# EAGLE design Main schematic (EAGLE 9.5.1)
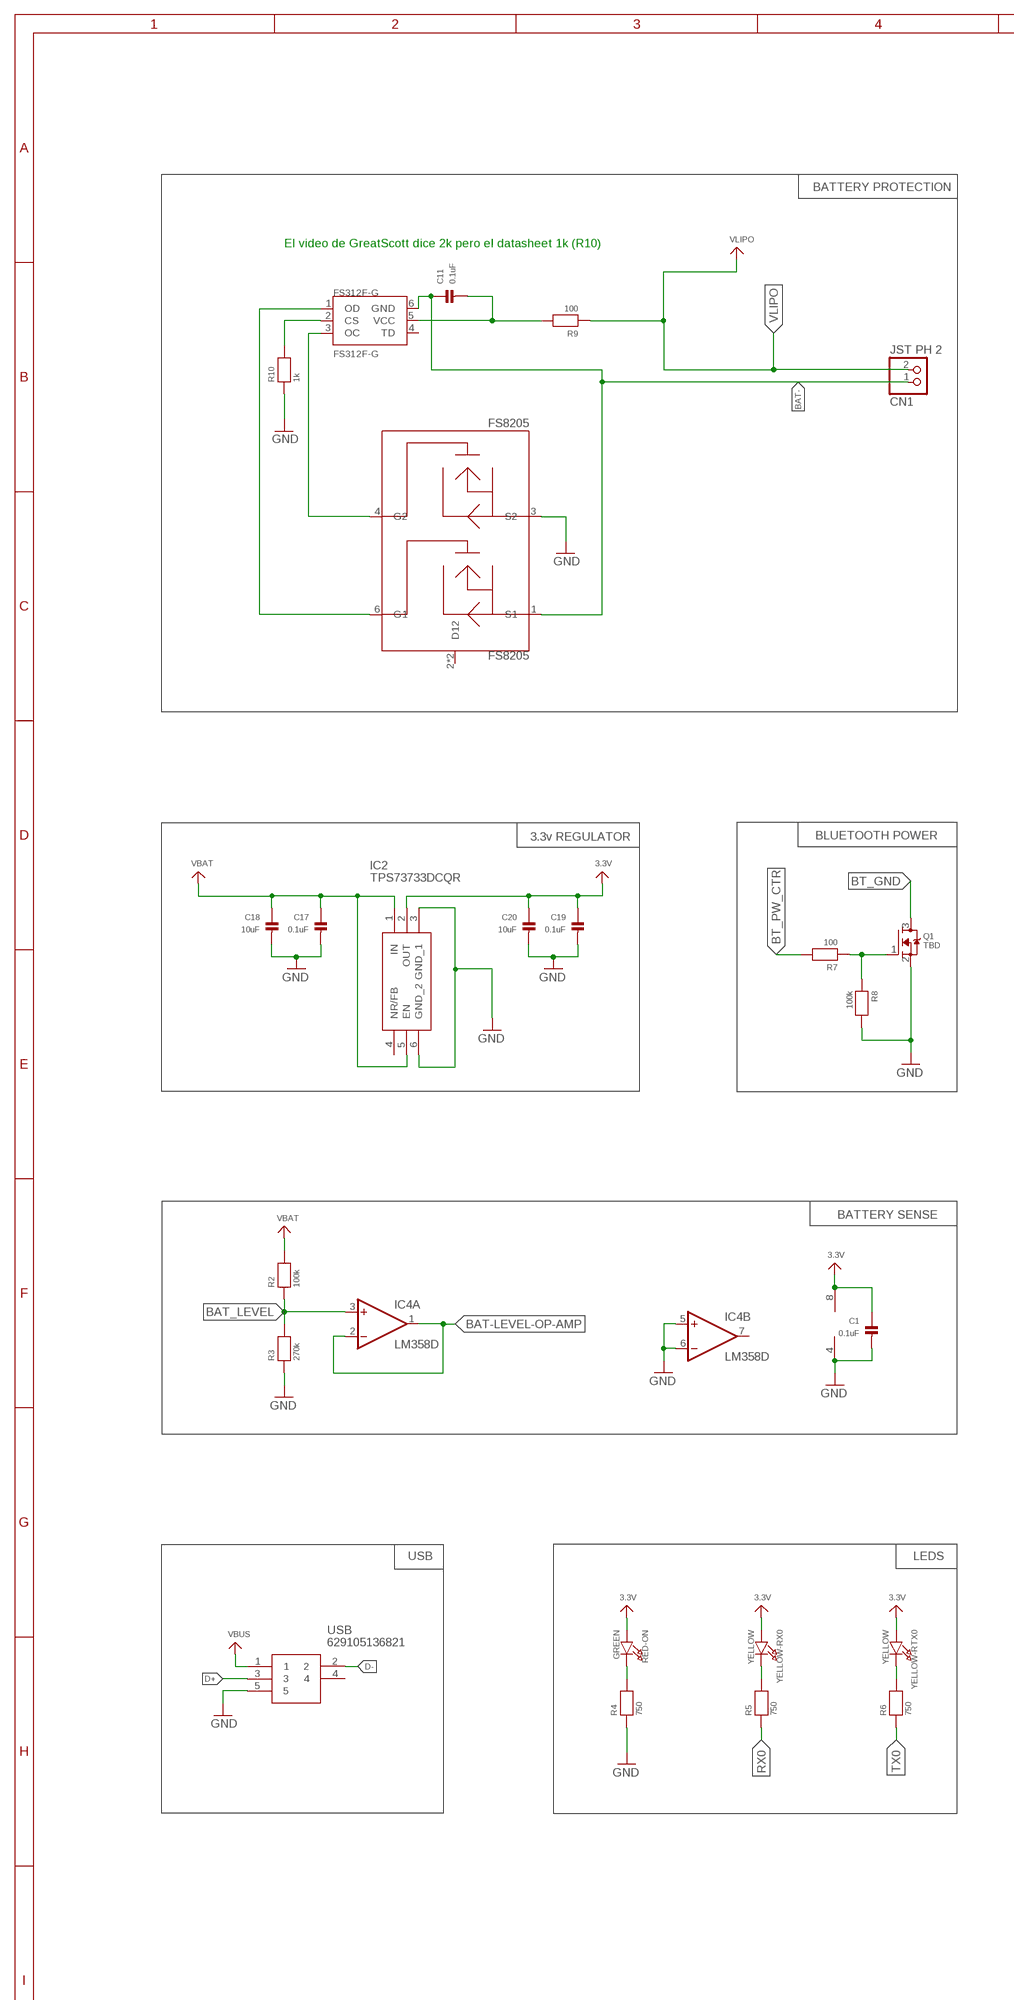
[diagram p0: schematic, sheet 1, part 1 of 2]
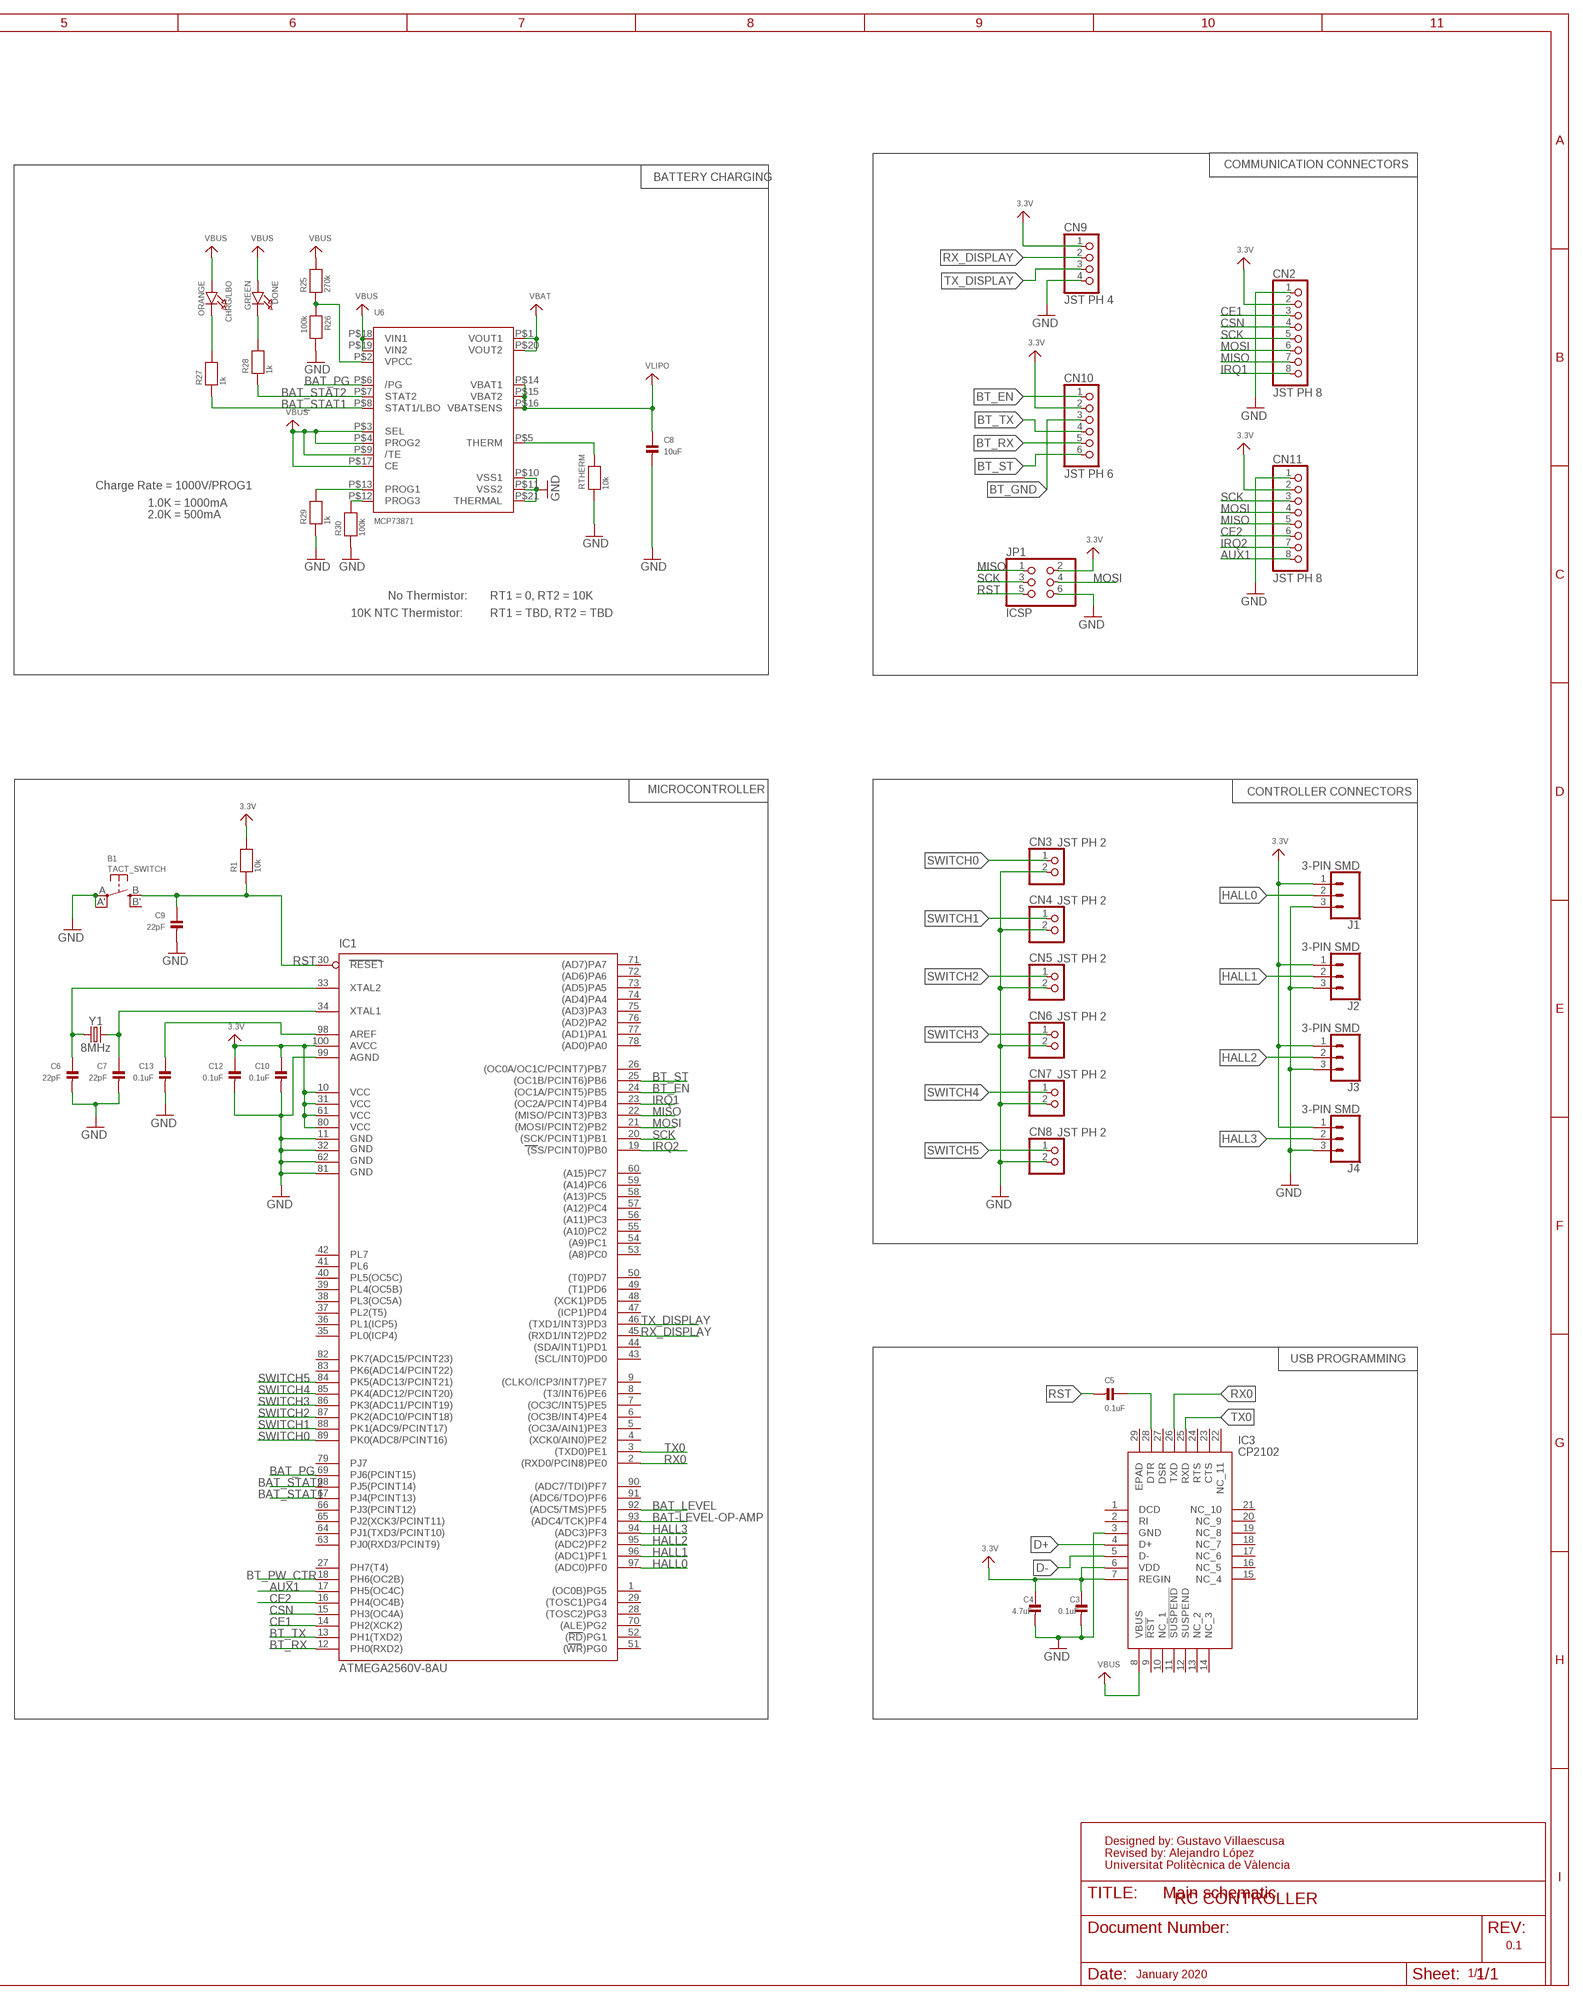
[diagram p1: schematic, sheet 1, part 2 of 2]

## Parts
B1  TACT_SWITCH  SWITCH_TACT_SMT4.6X2.8  [BTN_KMR2_4.6X2.8]
C1  0.1uF  CAP_CERAMIC0805  [0805]
C3  0.1uF  CAP_CERAMIC0805  [0805]
C4  4.7uF  CAP_CERAMIC0805  [0805]
C5  0.1uF  CAP_CERAMIC0805  [0805]
C6  22pF  CAP_CERAMIC0805  [0805]
C7  22pF  CAP_CERAMIC0805  [0805]
C8  10uF  CAP_CERAMIC0805  [0805]
C9  22pF  CAP_CERAMIC0805  [0805]
C10  0.1uF  CAP_CERAMIC0805  [0805]
C11  0.1uF  CAP_CERAMIC0805  [0805]
C12  0.1uF  CAP_CERAMIC0805  [0805]
C13  0.1uF  CAP_CERAMIC0805  [0805]
C17  0.1uF  CAP_CERAMIC0805  [0805]
C18  10uF  CAP_CERAMIC0805  [0805]
C19  0.1uF  CAP_CERAMIC0805  [0805]
C20  10uF  CAP_CERAMIC0805  [0805]
CHRG/LBO  ORANGE  LED0805  [CHIPLED_0805]
CN1  JST PH 2  JST_2PIN  [JSTPH2]
CN2  JST PH 8  JST_8PIN  [JSTPH8]
CN3  JST PH 2  JST_2PIN  [JSTPH2]
CN4  JST PH 2  JST_2PIN  [JSTPH2]
CN5  JST PH 2  JST_2PIN  [JSTPH2]
CN6  JST PH 2  JST_2PIN  [JSTPH2]
CN7  JST PH 2  JST_2PIN  [JSTPH2]
CN8  JST PH 2  JST_2PIN  [JSTPH2]
CN9  JST PH 4  JST_4PIN  [JSTPH4]
CN10  JST PH 6  JST_6PIN  [JSTPH6]
CN11  JST PH 8  JST_8PIN  [JSTPH8]
DONE  GREEN  LED0805  [CHIPLED_0805]
FS312F-G  FS312F-G  [SOT23-6]
FS8205  FS8205  [SOT23-6]
IC1  ATMEGA2560V-8AU  [TQFP100]
IC2  TPS73733DCQR  [SOT127P706X180-6N]
IC3  CP2102  [QFN50P500X500X100-29N]
IC4  LM358D  [SO08]
J1  3-PIN SMD  CONN_03JST-SMD  [JST-3-SMD]
J2  3-PIN SMD  CONN_03JST-SMD  [JST-3-SMD]
J3  3-PIN SMD  CONN_03JST-SMD  [JST-3-SMD]
J4  3-PIN SMD  CONN_03JST-SMD  [JST-3-SMD]
JP1  ICSP  HEADER-2X3  [2X03_ROUND_70MIL]
Q1  TBD  MOSFET-NWIDE  [SOT23-WIDE]
R1  10k  RESISTOR0805  [0805]
R2  100k  RESISTOR0805  [0805]
R3  270k  RESISTOR0805  [0805]
R4  750  RESISTOR0805  [0805]
R5  750  RESISTOR0805  [0805]
R6  750  RESISTOR0805  [0805]
R7  100  RESISTOR0805  [0805]
R8  100k  RESISTOR0805  [0805]
R9  100  RESISTOR0805  [0805]
R10  1k  RESISTOR0805  [0805]
R25  270k  RESISTOR0805  [0805]
R26  100k  RESISTOR0805  [0805]
R27  1k  RESISTOR0805  [0805]
R28  1k  RESISTOR0805  [0805]
R29  1k  RESISTOR0805  [0805]
R30  100k  RESISTOR0805  [0805]
RED-ON  GREEN  LED0805  [CHIPLED_0805]
RTHERM  10k  RESISTOR0805  [0805]
U6  MCP73871  [QFN20_4MM]
USB  629105136821  [MICRO-USB(2.0-SMT-TYPE-B)]
Y1  8MHz  CRYSTAL-8MHZSMD-HC49UP  [HC49UP]
YELLOW-RTX0  YELLOW  LED0805  [CHIPLED_0805]
YELLOW-RX0  YELLOW  LED0805  [CHIPLED_0805]

## Nets
3.3V: C1.1 C3.1 C4.1 C10.1 C12.1 C19.1 C20.1 CN2.2 CN9.1 CN10.2 CN11.2 IC1.10(VCC) IC1.31(VCC1) IC1.61(VCC2) IC1.80(VCC3) IC1.100(AVCC) IC2.2(OUT) IC3.6(VDD) IC3.7(REGIN) IC4.8(P:V+) J1.1 J2.1 J3.1 J4.1 JP1.2 R1.2 RED-ON.A YELLOW-RTX0.A YELLOW-RX0.A
AUX1: CN11.8 IC1.17(PH5(OC4C))
BAT-: C11.1 CN1.1 FS312F-G.6(GND) FS8205.1(S1)
BAT-LEVEL-OP-AMP: IC1.93((ADC4/TCK)PF4) IC4.1(A:OUT) IC4.2(A:-IN)
BAT_LEVEL: IC1.92((ADC5/TMS)PF5) IC4.3(A:+IN) R2.1 R3.2
BAT_PG: IC1.69(PJ6(PCINT15)) U6.P$6(/PG)
BAT_STAT1: IC1.67(PJ4(PCINT13)) R27.1 U6.P$8(STAT1/LBO)
BAT_STAT2: IC1.68(PJ5(PCINT14)) R28.1 U6.P$7(STAT2)
BT_EN: CN10.1 IC1.24((OC1A/PCINT5)PB5)
BT_GND: CN10.3 Q1.3(D)
BT_PW_CTR: IC1.18(PH6(OC2B)) R7.2
BT_RX: CN10.5 IC1.12(PH0(RXD2))
BT_ST: CN10.6 IC1.25((OC1B/PCINT6)PB6)
BT_TX: CN10.4 IC1.13(PH1(TXD2))
CE1: CN2.3 IC1.14(PH2(XCK2))
CE2: CN11.6 IC1.16(PH4(OC4B))
CSN: CN2.4 IC1.15(PH3(OC4A))
D+: IC3.4(D+) USB.3
D-: IC3.5(D-) USB.2
GND: B1.A'(P1) B1.A(P) C1.2 C3.2 C4.2 C6.2 C7.2 C8.2 C9.2 C10.2 C12.2 C13.2 C17.2 C18.2 C19.2 C20.2 CN2.1 CN3.2 CN4.2 CN5.2 CN6.2 CN7.2 CN8.2 CN9.4 CN11.1 FS8205.3(S2) IC1.11(GND) IC1.32(GND1) IC1.62(GND2) IC1.81(GND3) IC1.99(AGND) IC2.3(GND_1) IC2.6(GND_2) IC3.3(GND) IC4.4(P:V-) IC4.5(B:+IN) IC4.6(B:-IN) J1.3 J2.3 J3.3 J4.3 JP1.6 Q1.2(S) R3.1 R4.1 R8.2 R10.1 R26.2 R29.1 R30.1 RTHERM.1 U6.P$10(VSS1) U6.P$11(VSS2) U6.P$21(THERMAL) USB.5
GREEN: DONE.C R28.2
HALL0: IC1.97((ADC0)PF0) J1.2
HALL1: IC1.96((ADC1)PF1) J2.2
HALL2: IC1.95((ADC2)PF2) J3.2
HALL3: IC1.94((ADC3)PF3) J4.2
IRQ1: CN2.8 IC1.23((OC2A/PCINT4)PB4)
IRQ2: CN11.7 IC1.19((SS/PCINT0)PB0)
MISO: CN2.7 CN11.5 IC1.22((MISO/PCINT3)PB3) JP1.1
MOSI: CN2.6 CN11.4 IC1.21((MOSI/PCINT2)PB2) JP1.4
N$1: C6.1 IC1.33(XTAL2) Y1.1
N$2: C13.1 IC1.98(AREF)
N$3: C5.1 IC3.28(DTR)
N$4: C7.1 IC1.34(XTAL1) Y1.2
N$5: R4.2 RED-ON.C
N$6: R5.2 YELLOW-RX0.C
N$7: RTHERM.2 U6.P$5(THERM)
N$8: R25.1 R26.1 U6.P$2(VPCC)
N$9: R6.2 YELLOW-RTX0.C
N$10: C11.2 FS312F-G.5(VCC) R9.2
N$12: Q1.1(G) R7.1 R8.1
N$16: FS312F-G.3(OC) FS8205.4(G2)
N$17: FS312F-G.1(OD) FS8205.6(G1)
N$18: FS312F-G.2(CS) R10.2
N$25: R29.2 U6.P$13(PROG1)
N$29: R30.2 U6.P$12(PROG3)
ORANGE: CHRG/LBO.C R27.2
RST: B1.B(S) C5.2 C9.1 IC1.30(RESET) JP1.5 R1.1
RX0: IC1.2((RXD0/PCIN8)PE0) IC3.26(TXD) R5.1
RX_DISPLAY: CN9.2 IC1.45((RXD1/INT2)PD2)
SCK: CN2.5 CN11.3 IC1.20((SCK/PCINT1)PB1) JP1.3
SWITCH0: CN3.1 IC1.89(PK0(ADC8/PCINT16))
SWITCH1: CN4.1 IC1.88(PK1(ADC9/PCINT17))
SWITCH2: CN5.1 IC1.87(PK2(ADC10/PCINT18))
SWITCH3: CN6.1 IC1.86(PK3(ADC11/PCINT19))
SWITCH4: CN7.1 IC1.85(PK4(ADC12/PCINT20))
SWITCH5: CN8.1 IC1.84(PK5(ADC13/PCINT21))
TX0: IC1.3((TXD0)PE1) IC3.25(RXD) R6.1
TX_DISPLAY: CN9.3 IC1.46((TXD1/INT3)PD3)
VBAT: C17.1 C18.1 IC2.1(IN) IC2.5(EN) R2.2 U6.P$1(VOUT1) U6.P$20(VOUT2)
VBUS: CHRG/LBO.A DONE.A IC3.8(VBUS) R25.2 U6.P$3(SEL) U6.P$4(PROG2) U6.P$9(/TE) U6.P$17(CE) U6.P$18(VIN1) U6.P$19(VIN2) USB.1
VLIPO: C8.1 CN1.2 R9.1 U6.P$14(VBAT1) U6.P$15(VBAT2) U6.P$16(VBATSENS)
Unconnected: B1.B'(S1) FS312F-G.4(TD) FS8205.2(D12) FS8205.5(D12) IC1.1((OC0B)PG5) IC1.4((XCK0/AIN0)PE2) IC1.5((OC3A/AIN1)PE3) IC1.6((OC3B/INT4)PE4) IC1.7((OC3C/INT5)PE5) IC1.8((T3/INT6)PE6) IC1.9((CLKO/ICP3/INT7)PE7) IC1.26((OC0A/OC1C/PCINT7)PB7) IC1.27(PH7(T4)) IC1.28((TOSC2)PG3) IC1.29((TOSC1)PG4) IC1.35(PL0(ICP4)) IC1.36(PL1(ICP5)) IC1.37(PL2(T5)) IC1.38(PL3(OC5A)) IC1.39(PL4(OC5B)) IC1.40(PL5(OC5C)) IC1.41(PL6) IC1.42(PL7) IC1.43((SCL/INT0)PD0) IC1.44((SDA/INT1)PD1) IC1.47((ICP1)PD4) IC1.48((XCK1)PD5) IC1.49((T1)PD6) IC1.50((T0)PD7) IC1.51((WR)PG0) IC1.52((RD)PG1) IC1.53((A8)PC0) IC1.54((A9)PC1) IC1.55((A10)PC2) IC1.56((A11)PC3) IC1.57((A12)PC4) IC1.58((A13)PC5) IC1.59((A14)PC6) IC1.60((A15)PC7) IC1.63(PJ0(RXD3/PCINT9)) IC1.64(PJ1(TXD3/PCINT10)) IC1.65(PJ2(XCK3/PCINT11)) IC1.66(PJ3(PCINT12)) IC1.70((ALE)PG2) IC1.71((AD7)PA7) IC1.72((AD6)PA6) IC1.73((AD5)PA5) IC1.74((AD4)PA4) IC1.75((AD3)PA3) IC1.76((AD2)PA2) IC1.77((AD1)PA1) IC1.78((AD0)PA0) IC1.79(PJ7) IC1.82(PK7(ADC15/PCINT23)) IC1.83(PK6(ADC14/PCINT22)) IC1.90((ADC7/TDI)PF7) IC1.91((ADC6/TDO)PF6) IC2.4(NR/FB) IC3.1(DCD) IC3.2(RI) IC3.9(!RST) IC3.10(NC_1) IC3.11(!SUSPEND) IC3.12(SUSPEND) IC3.13(NC_2) IC3.14(NC_3) IC3.15(NC_4) IC3.16(NC_5) IC3.17(NC_6) IC3.18(NC_7) IC3.19(NC_8) IC3.20(NC_9) IC3.21(NC_10) IC3.22(NC_11) IC3.23(CTS) IC3.24(RTS) IC3.27(DSR) IC3.29(EPAD) IC4.7(B:OUT) USB.4

## Notes on the sheet
- COMMUNICATION CONNECTORS
- BATTERY PROTECTION | BATTERY CHARGING
- El video de GreatScott dice 2k pero el datasheet 1k (R10)
- Charge Rate = 1000V/PROG1
- 1.0K = 1000mA
- 2.0K = 500mA
- No Thermistor: | RT1 = 0, RT2 = 10K
- 10K NTC Thermistor: | RT1 = TBD, RT2 = TBD
- BLUETOOTH POWER | MICROCONTROLLER | CONTROLLER CONNECTORS
- 3.3v REGULATOR
- BATTERY SENSE
- USB PROGRAMMING
- USB | LEDS
- Designed by: Gustavo Villaescusa
  Revised by: Alejandro López
  Universitat Politècnica de Vàlencia
- RC CONTROLLER
- 0.1
- January 2020 | 1/1

## Library data of the parts
B1 = microbuilder:SWITCH_TACT_SMT: SMT Tact Switches 6x6mm - Digikey: P12940SCT-ND KMR2 (4.6x2.8mm) - Digikey: 401-1426-1-ND EVQ-PQHB55 - Light Touch, 160GF (4.5x4.5mm) - Digikey: P8090SCT-ND
C1 C3-C13 C17-C20 = microbuilder:CAP_CERAMIC: Ceramic Capacitors 0402 - 0402 Surface Mount Capacitors 16pF 50V 5% [Digikey: 445-4899-2-ND] 18pF 50V 5% [Digikey: 490-1281-2-ND] 22pF 50V 5% [Digikey: 490-1283-2-ND] 68pF 50V 5% [Digikey: 490-1289-2-ND] 0.1uF 10V 10% [Digikey: 490-1318-2-ND] 1.0uF 6.3V 10% [Digikey: 490-1320-2-ND] 0603 - 0603 Surface Mount Capacitors 16 pF 50V 5% [Digikey: 445-5051-2-ND] 22 pF 50V [Digikey: PCC220ACVTR-ND] 33 pF 50V 5% [Digikey: 490-1415-1-ND] 56pF 50V 5% [Digikey: 490-1421-1-ND] 220pF 50V 5% [Digikey: 445-1285-1-ND] 680 pF 50V 2200 pF 50V 5% C0G [Digikey: 445-1297-1-ND] 5600 pF 100V 5% X7R [Digikey: 478-3711-1-ND] 0.1 µF 25V 10% [Digikey: PCC2277TR-ND] 0.22 µF 16V 10% X7R [Digikey: 445-1318-1-ND] 1.0 µF 25V 10% [Digikey: 445-5146-2-ND] 0603 - RF Specific 3pF 250V +/-0.1pF RF [Digikey: 712-1347-1-ND] 18 pF 250V 5% [Digikey: 478-3505-1-ND or 712-1322-1-ND] 56 pF 250V 5% C0G RF [Digikey: 490-4867-1-ND] 68 pF 250V RF [Digikey: 490-4868-1-ND] 0805 - 0805 Surface Mount Capacitors 220 pF 250V 2% RF Ceramic Capacitor [Digikey: 712-1398-1-ND] 1000 pF 50V 2% NP0 Ceramic Capacitor [Digikey: 478-3760-1-ND] 0.1 µF 25V 10% Ceramic Capacitor [Digikey: PCC1828TR-ND] 1.0 µF 16V 10% Ceramic Capacitor[Digikey: 490-1691-2-ND] 10.0 µF 10V 10% Ceramic Capacitor[Digikey: 709-1228-1-ND] 10.0 uF 16V 10% Ceramic Capacitor [Digikey: 478-5165-2-ND] 47 uF 6.3V 20% Ceramic Capacitor [Digikey: 587-1779-1-ND or 399-5506-1-ND] 1206 - 1206 Surface Mount Capacitors 47uF 10V 20% Ceramic Capacitor [Digikey: 490-5528-1-ND or 399-5508-1-ND or 445-6010-1-ND] 100uF 6.3V -20%, +80% Y5V Ceramic Capacitor (Digikey: 490-4512-1-ND, Mouser: 81-GRM31CF50J107ZE1L)
CHRG/LBO DONE RED-ON YELLOW-RTX0 YELLOW-RX0 = microbuilder:LED: LED 0603 - 0603 Surface Mount Package 2mA: Green LED - Low Power (3.9mcd, 2ma, 1.7Vf) - Digikey: 475-2709-2-ND Orange LED - Low Power (9.8mcd, 2ma, 1.8Vf) - Digikey: 475-1194-2-ND Red LED - Low Power (5mcd, 2ma, 1.8Vf) - Digikey: 475-1195-2-ND Yellow LED - Low Power (7mcd, 2ma, 1.8Vf) - Digikey: 475-1196-2-ND 5mA: Blue LED - Low Power (17mcd, 5ma, 2.9Vf) - Digikey: LNJ937W8CRACT-ND 0805 - 0805 Surface Mount Package 2mA: Red LED (8.8mcd, 2mA, 1.8Vf, Clear) - Low Power [Digikey: 475-2510-1-ND] Green LED (5mcd, 2mA, 1.8Vf, Clear) - Low Power [Digikey: 475-2730-1-ND] Yellow LED (11.3mcd, 2mA, 1.8Vf, Clear) - Low Power [Digikey: 475-2555-1-ND] 20mA: Red LED (104mcd, 20mA, Diffused) - LS R976 [Digikey: 475-1278-6-ND] Red LED (12mcd, 20mA, 2.0Vf, Clear) - APT2012EC [Digikey: 754-1128-1-ND] Green LED (15mcd, 20mA, 2.2Vf, Clear) - APT2012GC [Digikey: 754-1131-1-ND] Orange LED (160mcd, 20mA, 2.1Vf, Clear) - APT2012SECK [Digikey: 754-1130-1-ND] 1206 - 1206 Surface Mount Package Green LED (26mcd, 20mA, Diffused) - LG N971 [Digikey: 475-1407-6-ND] Red LED (15mcd, 20mA, Diffused) - LH N974 [Digikey: 475-1416-6-ND]
CN1 CN3-CN8 = microbuilder:JST_2PIN: JST 2-Pin Right-Angle Connector PH-Series - 4UConnector: 17311 SH-Series - 4UConnector: 07278
CN2 CN11 = microbuilder:JST_8PIN: JST 8-Pin Right-Angle Connector
CN9 = microbuilder:JST_4PIN: JST 4-Pin Right-Angle Connector 4UConnector: 17312
CN10 = microbuilder:JST_6PIN: JST 6-Pin Right-Angle Connector
FS312F-G = fs321f-g:FS312F-G
FS8205 = fs8205:FS8205
IC1 = atmel-2005:ATMEGA*: MICROCONTROLLER 64/128/256 Kbytes FLASH 4 Kbytes EEPROM 8 Kbytes SRAM 86 General Purpose I/O pins 12-channels16-bit PWM 4 x Serial USARTs 16-channels 10-bit A/D
IC2 = SamacSys_Parts:TPS73733DCQR: Single Output LDO, 1A, Adj. (1.2 to 5.0V), Reverse Current Protection Source: Datasheet <http://www.ti.com/lit/gpn/tps737>; DESCRIPTION: Single Output LDO, 1A, Adj. (1.2 to 5.0V), Reverse Current Protection; HEIGHT: 1.8mm; MANUFACTURER_NAME: Texas Instruments; MANUFACTURER_PART_NUMBER: TPS73733DCQR; MOUSER_PART_NUMBER: 595-TPS73733DCQR; MOUSER_PRICE-STOCK: https://www.mouser.com/Search/Refine.aspx?Keyword=595-TPS73733DCQR
IC3 = SamacSys_Parts:CP2102: USB Interface IC Source: Datasheet <https://componentsearchengine.com/Datasheets/1/CP2102.pdf>; DESCRIPTION: USB Interface IC; HEIGHT: 1mm; MANUFACTURER_NAME: Silicon Labs; MANUFACTURER_PART_NUMBER: CP2102; MOUSER_PART_NUMBER: 634-CP2102; MOUSER_PRICE-STOCK: https://www.mouser.com/Search/Refine.aspx?Keyword=634-CP2102
IC4 = linear:LM358: OP AMP also LM158; LM258; LM2904 Source: http://cache.national.com/ds/LM/LM158.pdf
J1-J4 = SparkFun-Connectors:CONN_03: Multi connection point. Often used as Generic Header-pin footprint for 0.1 inch spaced/style header connections On any of the 0.1 inch spaced packages, you can populate with these: Break Away Headers - Straight <https://www.sparkfun.com/products/116> (PRT-00116) Break Away Male Headers - Right Angle <https://www.sparkfun.com/products/553> (PRT-00553) Female Headers <https://www.sparkfun.com/products/115> (PRT-00115) Break Away Headers - Machine Pin <https://www.sparkfun.com/products/117> (PRT-00117) Break Away Female Headers - Swiss Machine Pin <https://www.sparkfun.com/products/743> (PRT-00743) Stackable Header - 3 Pin (Female, 0.1") <https://www.sparkfun.com/products/13875> (PRT-13875) For SCREWTERMINALS and SPRING TERMINALS visit here: Screw Terimnals on SparkFun.com <https://www.sparkfun.com/search/results?term=Screw+Terminals> (5mm/3.5mm/2.54mm spacing) This device is also useful as a general connection point to wire up your design to another part of your project. Our various solder wires solder well into these plated through hole pads. Hook-Up Wire - Assortment (Stranded, 22 AWG) <https://www.sparkfun.com/products/11375> (PRT-11375) Hook-Up Wire - Assortment (Solid Core, 22 AWG) <https://www.sparkfun.com/products/11367> (PRT-11367) View the entire wire category on our website here <https://www.sparkfun.com/categories/141> Special notes: Molex polarized connector foot print use with SKU : PRT-08232 with associated crimp pins and housings.; PROD_ID: CONN-12591
JP1 = microbuilder:HEADER-2X3: PIN HEADER
Q1 = microbuilder:MOSFET-N: N-Channel Mosfet LEGEND VDS: Voltage Drain-Source ID: Drain Current RDS(ON): Drain-Source On-State Resistance VGS(TH): Gate-Source Threshold Voltage CISS: Drain-Source Input Capacitance SOT-23 Name VDS ID RDS(ON) VGS(TH) CISS Order Number 2N7002E 60V 260mA 2.5 Ohm 2.5V @ 250uA 26.7pF @ 25V 2N7002ET1GOSTR-ND BSH103 30V 850mA 400 mOhm 400mV @ 1mA 83pF @ 24V BSH103,235-ND BSS138 60V 320mA 1.6 Ohm 1.5V @ 250uA 50pF @ 10V Mouser: 771-BSS138PW115 DMN2075U-7 20V 4.2A 38 mOhm 1V @ 250 uA 594.3pF @ 10V DMN2075U-7DICT-ND * BSS138 good choice for I2C level-shifting
R1-R10 R25-R30 RTHERM = microbuilder:RESISTOR: Resistors 0402 - 0402 Surface Mount Package 22 Ohm 1% 1/16W [Digikey: 311-22.0LRTR-ND] 33 Ohm 5% 1/16W 1.0K 5% 1/16W 1.5K 5% 1/16W 2.0K 1% 1/16W 10.0K 1% 1/16W [Digikey: 311-10.0KLRTR-ND] 10.0K 5% 1/16W [Digikey: RMCF0402JT10K0TR-ND] 12.1K 1% 1/16W [Digikey: 311-22.0LRTR-ND] 100.0K 5% 1/16W 0603 - 0603 Surface Mount Package 0 Ohm 1/10 Watt 1% Resistor 15 Ohm 1/10 Watt 1% Resistor 33 Ohm 1/10 Watt 1% Resistor 49.9 Ohm 1/10 Watt 1% Resistor 100 Ohm 1/10 Watt 1% Resistor 150 Ohm 1/10 Watt 1% Resistor 240 Ohm 1/10 Watt 1% Resistor 390 Ohm 1/10 Watt 1% Resistor 560 Ohm 1/10 Watt 1% Resistor 680 Ohm 1/10 Watt 1% Resistor 750 Ohm 1/10 Watt 1% Resistor 1.0K Ohm 1/10 Watt 1% Resistor 1.5K Ohm 1/10 Watt 1% Resistor 2.0K Ohm 1/10 Watt 1% Resistor 2.2K Ohm 1/10 Watt 1% Resistor 3.3K Ohm 1/10 Watt 1% Resistor 4.7K Ohm 1/10 Watt 1% Resistor 10.0K Ohm 1/10 Watt 1% Resistor 12.0K Ohm 1/10 Watt 1% Resistor 12.1K Ohm 1/10 Watt 1% Resistor 20.0K Ohm 1/10 Watt 1% Resistor 33.0K Ohm 1/10 Watt 1% Resistor 100.0K Ohm 1/10 Watt 1% Resistor 0805 - 0805 Surface Mount Package 0 Ohm 1/8 Watt 1% Resistor 33 Ohm 1/8 Watt 1% Resistor 100 Ohm 1/8 Watt 1% Resistor 150 Ohm 1/8 Watt 1% Resistor 200 Ohm 1/8 Watt 1% Resistor 240 Ohm 1/8 Watt 1% Resistor 330 Ohm 1/8 Watt 1% Resistor 390 Ohm 1/8 Watt 1% Resistor 470 Ohm 1/8 Watt 1% Resistor 1.0K Ohm 1/8 Watt 1% Resistor 1.5K Ohm 1/8 Watt 1% Resistor 2.0K Ohm 1/8 Watt 1% Resistor 4.7K Ohm 1/8 Watt 1% Resistor 5.1K Ohm 1/8 Watt 1% Resistor 5.6K Ohm 1/8 Watt 1% Resistor 10.0K Ohm 1/8 Watt 1% Resistor 22.0K Ohm 1/8 Watt 1% Resistor 33.0K Ohm 1/8 Watt 1% Resistor 100K Ohm 1/8 Watt 1% Resistor 1206 - 1206 Surface Mount Package 2012 - 2010 Surface Mount Package 0.11 Ohm 1/2 Watt 1% Resistor - Digikey: RHM.11UCT-ND
U6 = microbuilder:MCP73871: MCP73871 Lithium Polymer Battery Charger Digikey: MCP73871-2CCI/ML-ND
USB = SamacSys_Parts:629105136821: Wurth Elektronik Right Angle SMT Female Type B Version 2 Micro USB Connector, 30 V ac, 1A Source: Datasheet <http://katalog.we-online.de/em/datasheet/629105136821.pdf>; DESCRIPTION: Wurth Elektronik Right Angle SMT Female Type B Version 2 Micro USB Connector, 30 V ac, 1A; HEIGHT: mm; MANUFACTURER_NAME: Wurth Elektronik; MANUFACTURER_PART_NUMBER: 629105136821; MOUSER_PART_NUMBER: 710-629105136821; MOUSER_PRICE-STOCK: https://www.mouser.com/Search/Refine.aspx?Keyword=710-629105136821; RS_PART_NUMBER: 8183361; RS_PRICE-STOCK: http://uk.rs-online.com/web/p/products/8183361
Y1 = SparkFun-Clocks:CRYSTAL-8MHZ: 8MHz Crystal Datasheet Example <http://www.futureelectronics.com/en/technologies/electromechanical/timing-devices/crystals/Pages/6008189-ABM3B-8.000MHZ-B2-T.aspx?IM=0> Frequency: 8MHz Frequency Tolerance: ±20ppm Load Capacitance: 18pF SparkFun Products: Pro Micro -3.3V/8MHz <https://www.sparkfun.com/products/12587> WAV Trigger <https://www.sparkfun.com/products/13660>; PROD_ID: XTAL-11706

## Board
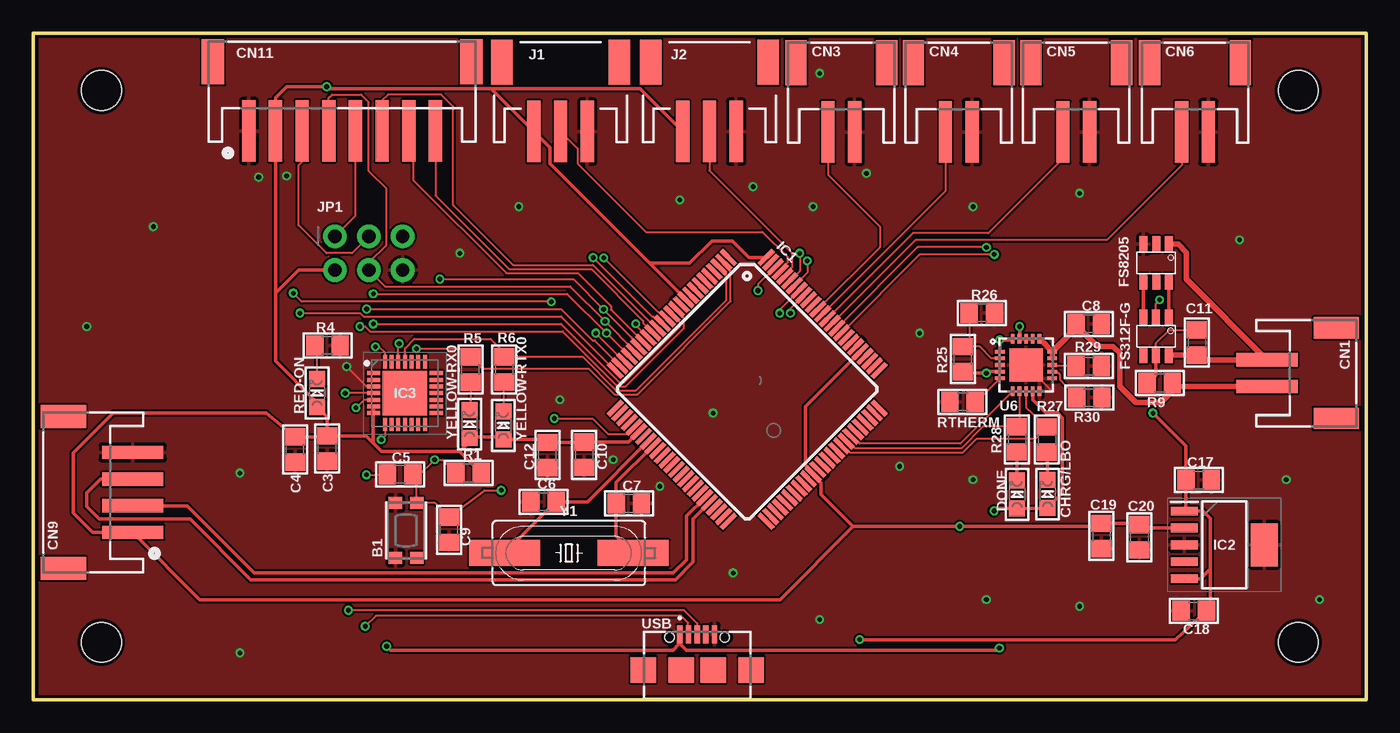
[diagram p2: board, top side]
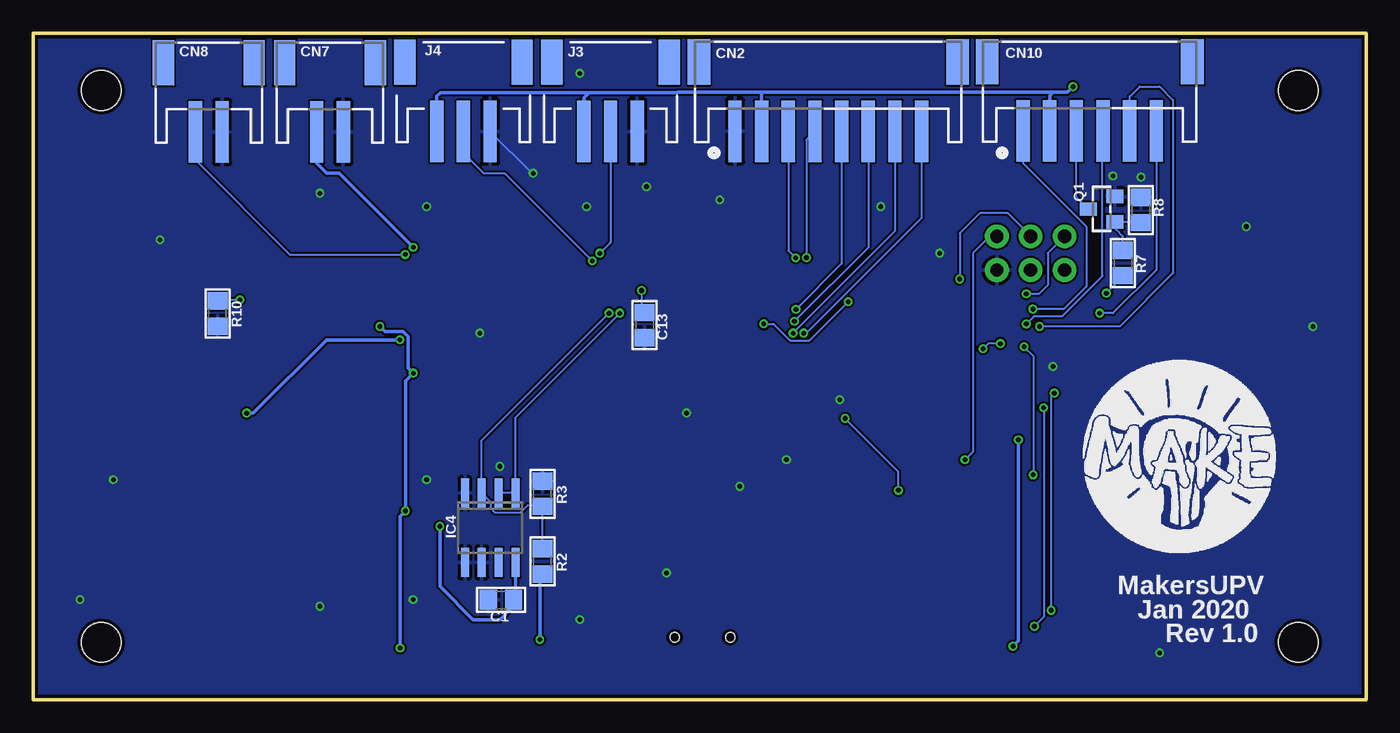
[diagram p3: board, bottom side, seen from below]

Size 100 x 50 mm. Coordinates in mm from the lower left corner, seen from the top.
Outline: 100,0 100,50 0,50 0,0 100,0
Copper layers (1*16): Top 0.035mm / dielectric 1.5mm / Bottom 0.035mm
Design rules "SeeedStudio_2layer_DRU_no_angle_20140221 *": minimum track width 6mil, minimum drill 12mil, track to track 6mil, track to pad 6mil, pad to pad 4mil, via to via 6mil, smd to smd 0mil, copper to edge 10mil, drill to drill 10mil, minimum pad ring 10mil, minimum via ring 6mil, stop-mask expansion 2mil, vias tented up to drill 100mil, thermal gap 10mil
Holes 3 mm at 5.1,4.3 94.9,4.3 94.9,45.7 5.1,45.7

### Footprints (pad centres in the part's own frame; a part is rotated, then mirrored left to right if it is on the bottom)
BTN_KMR2_4.6X2.8 = smd 0.9 x 1: A 2.05,0.8; A' -2.05,0.8; B 2.05,-0.8; B' -2.05,-0.8
0805 = smd 1.3 x 1.5: 1 -0.95,0; 2 0.95,0
CHIPLED_0805 = smd 1.2 x 1.2: A 0,-1.05; C 0,1.05
JSTPH2 = smd 1 x 4.6: 1 -1,-3.7; 2 1,-3.7 | smd 1.6 x 3.4: NC1 -3.4,1.5; NC2 3.4,1.5
JSTPH8 = smd 1 x 4.6: 1 -7,-3.7; 2 -5,-3.7; 3 -3,-3.7; 4 -1,-3.7; 5 1,-3.7; 6 3,-3.7; 7 5,-3.7; 8 7,-3.7 | smd 1.7 x 3.4: NC1 -9.7,1.5; NC2 9.7,1.5
JSTPH4 = smd 1 x 4.6: 1 -3,-3.7; 2 -1,-3.7; 3 1,-3.7; 4 3,-3.7 | smd 1.7 x 3.4: NC1 -5.7,1.5; NC2 5.7,1.5
JSTPH6 = smd 1 x 4.6: 1 -5,-3.7; 2 -3,-3.7; 3 -1,-3.7; 4 1,-3.7; 5 3,-3.7; 6 5,-3.7 | smd 1.7 x 3.4: NC1 -7.7,1.5; NC2 7.7,1.5
SOT23-6 = smd 0.6 x 1.2: 1 -0.95,-1.4; 2 0,-1.4; 3 0.95,-1.4; 4 0.95,1.4; 5 0,1.4; 6 -0.95,1.4
TQFP100 = smd 1.5 x 0.35: 1 -8,6; 2 -8,5.5; 3 -8,5; 4 -8,4.5; 5 -8,4; 6 -8,3.5; 7 -8,3; 8 -8,2.5; 9 -8,2; 10 -8,1.5; 11 -8,1; 12 -8,0.5; 13 -8,0; 14 -8,-0.5; 15 -8,-1; 16 -8,-1.5; 17 -8,-2; 18 -8,-2.5; 19 -8,-3; 20 -8,-3.5; 21 -8,-4; 22 -8,-4.5; 23 -8,-5; 24 -8,-5.5; 25 -8,-6; 51 8,-6; 52 8,-5.5; 53 8,-5; 54 8,-4.5; 55 8,-4; 56 8,-3.5; 57 8,-3; 58 8,-2.5; 59 8,-2; 60 8,-1.5; 61 8,-1; 62 8,-0.5; 63 8,0; 64 8,0.5; 65 8,1; 66 8,1.5; 67 8,2; 68 8,2.5; 69 8,3; 70 8,3.5; 71 8,4; 72 8,4.5; 73 8,5; 74 8,5.5; 75 8,6 | smd 0.35 x 1.5: 26 -6,-8; 27 -5.5,-8; 28 -5,-8; 29 -4.5,-8; 30 -4,-8; 31 -3.5,-8; 32 -3,-8; 33 -2.5,-8; 34 -2,-8; 35 -1.5,-8; 36 -1,-8; 37 -0.5,-8; 38 0,-8; 39 0.5,-8; 40 1,-8; 41 1.5,-8; 42 2,-8; 43 2.5,-8; 44 3,-8; 45 3.5,-8; 46 4,-8; 47 4.5,-8; 48 5,-8; 49 5.5,-8; 50 6,-8; 76 6,8; 77 5.5,8; 78 5,8; 79 4.5,8; 80 4,8; 81 3.5,8; 82 3,8; 83 2.5,8; 84 2,8; 85 1.5,8; 86 1,8; 87 0.5,8; 88 0,8; 89 -0.5,8; 90 -1,8; 91 -1.5,8; 92 -2,8; 93 -2.5,8; 94 -3,8; 95 -3.5,8; 96 -4,8; 97 -4.5,8; 98 -5,8; 99 -5.5,8; 100 -6,8
SOT127P706X180-6N = smd 2 x 0.65: 1 -3,2.54; 2 -3,1.27; 3 -3,0; 4 -3,-1.27; 5 -3,-2.54 | smd 2 x 3.2: 6 3,0
QFN50P500X500X100-29N = smd 1 x 0.3: 1 -2.35,1.5; 2 -2.35,1; 3 -2.35,0.5; 4 -2.35,0; 5 -2.35,-0.5; 6 -2.35,-1; 7 -2.35,-1.5; 15 2.35,-1.5; 16 2.35,-1; 17 2.35,-0.5; 18 2.35,0; 19 2.35,0.5; 20 2.35,1; 21 2.35,1.5 | smd 0.3 x 1: 8 -1.5,-2.35; 9 -1,-2.35; 10 -0.5,-2.35; 11 0,-2.35; 12 0.5,-2.35; 13 1,-2.35; 14 1.5,-2.35; 22 1.5,2.35; 23 1,2.35; 24 0.5,2.35; 25 0,2.35; 26 -0.5,2.35; 27 -1,2.35; 28 -1.5,2.35 | smd 3.35 x 3.35: 29 0,0
SO08 = smd 0.6 x 2.2: 1 -1.905,-2.6; 2 -0.635,-2.6; 3 0.635,-2.6; 4 1.905,-2.6; 5 1.905,2.6; 6 0.635,2.6; 7 -0.635,2.6; 8 -1.905,2.6
JST-3-SMD = smd 1 x 4.6: 1 -1.99,-4.77; 2 0.01,-4.77; 3 2.01,-4.77 | smd 1.6 x 3.4: NC1 -4.39,0.43; NC2 4.41,0.43
2X03_ROUND_70MIL = drill 1 pad 1.778: 1 -2.54,1.27; 2 -2.54,-1.27; 3 0,1.27; 4 0,-1.27; 5 2.54,1.27; 6 2.54,-1.27
SOT23-WIDE = smd 1 x 1.27: 1 -0.95,-1; 2 0.95,-1; 3 0,1
QFN20_4MM = smd 0.73 x 0.28: P$1 -1.965,1; P$2 -1.965,0.5; P$3 -1.965,0; P$4 -1.965,-0.5; P$5 -1.965,-1; P$11 1.965,-1; P$12 1.965,-0.5; P$13 1.965,0; P$14 1.965,0.5; P$15 1.965,1 | smd 0.28 x 0.73: P$6 -1,-1.965; P$7 -0.5,-1.965; P$8 0,-1.965; P$9 0.5,-1.965; P$10 1,-1.965; P$16 1,1.965; P$17 0.5,1.965; P$18 0,1.965; P$19 -0.5,1.965; P$20 -1,1.965 | smd 2.5 x 2.5: P$21 0,0
MICRO-USB(2.0-SMT-TYPE-B) = smd 0.4 x 1.35: 1 -1.3,4.825; 2 -0.65,4.825; 3 0,4.825; 4 0.65,4.825; 5 1.3,4.825 | smd 1.9 x 1.9: 6 -4.05,2.15; 7 -1.2,2.15; 8 1.2,2.15; 9 4.05,2.15 | hole 0.7: -2.075,4.6; 2.075,4.6
HC49UP = smd 5.334 x 1.93: 1 -4.826,0; 2 4.826,0

### Placement (x,y rotation side)
B1  27.97,12.7 90 top
C1  64.92,7.46 180 bottom
C3  22.04,18.83 270 top
C4  19.63,18.77 270 top
C5  27.52,16.91 0 top
C6  38.29,14.84 180 top
C7  44.68,14.72 0 top
C8  79.19,28.2 0 top
C9  31.18,12.74 270 top
C10  41.34,18.37 270 top
C11  87.3,26.79 90 top
C12  38.58,18.34 270 top
C13  54.14,28.1 270 bottom
C17  87.44,16.47 0 top
C18  87.06,6.65 180 top
C19  80.14,12.27 270 top
C20  82.98,12.18 270 top
CHRG/LBO  76.09,15.42 0 top
CN1  96.25,24.5 270 top
CN2  40.36,46.35 0 bottom
CN3  60.62,46.29 0 top
CN4  69.43,46.29 0 top
CN5  78.24,46.29 0 top
CN6  87.15,46.29 0 top
CN7  77.74,46.29 0 bottom
CN8  86.83,46.29 0 bottom
CN9  3.75,15.54 90 top
CN10  20.75,46.37 0 bottom
CN11  23.17,46.37 0 top
DONE  73.81,15.39 0 top
FS312F-G  84.23,27.27 180 top
FS8205  84.24,32.77 180 top
IC1  53.56,23.28 315 top
IC2  89.35,11.61 0 top
IC3  27.88,23 0 top
IC4  65.72,12.89 180 bottom
J1  39.55,47.4 0 top
J2  50.72,47.4 0 top
J3  56.71,47.4 0 bottom
J4  67.74,47.4 0 bottom
JP1  25.17,33.5 0 top
Q1  19.85,36.81 90 bottom
R1  32.65,17.01 0 top
R2  61.8,10.37 270 bottom
R3  61.8,15.45 270 bottom
R4  22.07,26.59 180 top
R5  32.8,24.77 270 top
R6  35.33,24.78 270 top
R7  18.25,32.77 270 bottom
R8  16.91,36.74 90 bottom
R9  84.51,23.76 180 top
R10  86.19,28.96 90 bottom
R25  69.73,25.54 270 top
R26  71.17,29.02 0 top
R27  76.06,19.5 270 top
R28  73.81,19.54 270 top
R29  79.19,25.02 180 top
R30  79.22,22.65 180 top
RED-ON  21.29,23.01 0 top
RTHERM  69.72,22.35 0 top
U6  74.48,25.11 0 top
USB  49.8,0.07 0 top
Y1  40.18,11 0 top
YELLOW-RTX0  35.27,20.57 0 top
YELLOW-RX0  32.73,20.66 0 top

### Tracks (layer width: path | path; a pad name or v marks a point on that pad's centre or on a via)
3.3V  (via drill 0.35)
  Top 0.254: IC2.2 83.11,12.88 C20.1 82.89,13.22 C19.1 80.06,13 v69.5,13 61.5,13 | 61.5,13 59.09,15.41 59.09,16.27 58.51,16.85 IC1.61 58.51,16.98 57.93,17.56 57.93,21.99 IC1.80 | 61.5,13 56,7.5 12.49,7.5 CN9.1 4.46,12.54 3,14 3,18.5 6,21.5 17.45,21.5 C4.1 21.98,19.72 C3.1 | IC3.6 IC3.7 25.49,21.46 25.49,19.25 | R1.2 32,18.61 | 25.49,19.25 26.14,18.61 32,18.61 | 32,18.61 32.73,19.34 | 32.73,19.34 33.1,19.71 35.16,19.71 YELLOW-RTX0.A 38.35,19.52 C12.1 41.3,19.29 C10.1 44.65,19.32 IC1.31 | 32.73,19.34 YELLOW-RX0.A | 18.17,30.5 18.17,25.4 21.15,22.42 RED-ON.A 22.04,21.21 C3.1 | 18.17,30.5 CN11.2 18.17,45.17 19,46 v22,46 22.15,45.85 34.34,45.85 | J2.1 45.51,45.85 34.34,45.85 | 34.34,45.85 J1.1 38.78,41.41 38.78,40.21 46.25,32.75 | JP1.2 19.9,32.23 18.17,30.5 | IC1.10 48.96,30.03 46.25,32.75 | IC1.100 53.69,33.18 52.45,34.41 50.91,34.41 49.25,32.75 46.25,32.75 | C3.1 24.96,19.78 25.49,19.25
  Bottom 0.254: 45.3,45.57 23.5,45.57 | 23.5,45.57 22.43,45.57 v22,46 | 45.3,45.57 51.66,45.57 51.68,45.55 58.3,45.55 | v69.5,13 69.5,8.5 67,6 65,6 64.14,6.86 64.03,7.25 | 64.03,7.25 C1.1 | 58.3,45.55 69.45,45.55 69.73,45.27 J4.1 | J3.1 58.7,45.15 58.3,45.55 | CN2.2 45.36,45.51 45.3,45.57 | CN10.2 23.75,45.32 23.5,45.57 | IC4.8 63.81,7.46 64.03,7.25
AUX1
  Top 0.152: CN11.8 30.17,37.83 35.7,32.3 41.87,32.3 45.75,28.42 45.75,28.26 IC1.17
BAT-
  Top 0.406: FS8205.1 85.89,34.17 86.5,33.56 86.5,31.55 CN1.1 87.64,25.5 C11.1 87.27,25.87 FS312F-G.6
BAT-LEVEL-OP-AMP  (via drill 0.35)
  Top 0.152: v56,29 56,29.26 IC1.93
  Bottom 0.152: v56,29 63.81,21.18 IC4.1 IC4.2
BAT_LEVEL  (via drill 0.35)
  Top 0.152: v56.81,29 56.81,29.36 IC1.92
  Bottom 0.152: R2.1 R3.2 62.9,14.6 63.44,14.06 65.38,14.06 65.7,14.38 65.7,14.84 IC4.3 66.36,19.45 v56.81,29
BAT_PG
  Top 0.152: IC1.69 61.48,19.74 62,19.21 69.55,19.21 U6.P$6
BAT_STAT1
  Top 0.152: U6.P$8 74.48,21.93 R27.1 75.17,19.56 70.76,19.56 69.7,18.51 61.3,18.51 60.77,19.04 IC1.67
BAT_STAT2
  Top 0.152: IC1.68 61.12,19.39 61.65,18.86 69.63,18.86 71.26,20.49 72.17,20.49 R28.1 73.98,20.66 U6.P$7
BT_EN  (via drill 0.35)
  Top 0.152: IC1.24 42.12,26.94 41.96,26.94 39.61,29.3 v25,29.3
  Bottom 0.152: CN10.1 25.75,40.25 21,35.5 21,31 22.7,29.3 v25,29.3
BT_GND
  Bottom 0.152: CN10.3 21.75,37.71 Q1.3
BT_PW_CTR  (via drill 0.35)
  Top 0.152: IC1.18 45.19,28.11 v45.19,28.19 | v38.86,29.86 20.14,29.86 v19.5,30.5
  Bottom 0.152: v45.19,28.19 44.48,28.19 43.23,26.94 41.77,26.94 v38.86,29.86 | v19.5,30.5 18.25,31.75 R7.2
BT_RX  (via drill 0.35)
  Top 0.152: v24.5,28 24.9,28 25.27,27.63 39.72,27.63 43.85,23.51 44.44,23.51 48.8,27.87 48.8,28.61 48.26,29.15 IC1.12
  Bottom 0.152: CN10.5 17.75,45.25 17,46 15.5,46 14.5,45 14.5,32 18.5,28 v24.5,28
BT_ST  (via drill 0.35)
  Top 0.152: v20,29 24.52,29 24.77,28.75 39.61,28.75 IC1.25
  Bottom 0.152: v20,29 19,29 15.75,32.25 CN10.6
BT_TX  (via drill 0.35)
  Top 0.152: v25.5,28.19 39.59,28.19 43.97,23.81 44.31,23.81 48.5,28 48.5,28.34 IC1.13
  Bottom 0.152: v25.5,28.19 24.94,28.75 22.82,28.75 19.78,31.78 19.78,42.64 CN10.4
CE1  (via drill 0.35)
  Top 0.152: v42.81,33.15 46.84,29.11 46.88,29.11 47.41,28.58 IC1.14
  Bottom 0.152: CN2.3 43.36,33.7 v42.81,33.15
CE2
  Top 0.152: IC1.16 46.73,27.88 41.99,32.61 36,32.61 31.5,37.11 31.5,44.5 30.6,45.4 26.6,45.4 26.17,44.97 CN11.6
CSN  (via drill 0.35)
  Top 0.152: v42,33.17 46.41,28.76 46.53,28.76 47.06,28.23 IC1.15
  Bottom 0.152: CN2.4 42,42.01 v42,33.17
D+  (via drill 0.35)
  Top 0.152: IC3.4 v23.39,23 | USB.3 49.8,5.73 48.83,6.7 v23.64,6.7
  Bottom 0.152: v23.39,23 23.64,22.75 v23.64,6.7
D-  (via drill 0.35)
  Top 0.152: IC3.5 24.8,22.5 v24.2,21.9 | USB.2 49.13,4.92 49.13,5.77 48.6,6.3 25.7,6.3 v24.9,5.5
  Bottom 0.152: v24.2,21.9 24.2,6.2 v24.9,5.5
GND  (via drill 0.35)
  Top 0.152: U6.P$21 76.5,23.09 | IC3.3 25,23.5 v23.5,25
  Bottom 0.152: J4.3 62.6,39.5 v62.5,39.5
  other vias: 39.5,22.5 43.5,18 47,16 52.5,9.5 70.5,37 66.5,27.5 36.42,37 90.5,34.5 78.5,38 70.5,16.5 94,16.5 96.5,7.5 78.5,7 71.5,7.5 59,6 15.5,3.5 15.5,17 4,28 9,35.5 32,33.5 54,38.5 48.5,37.5 58.5,37 51,21.5 59,47 65,17.5 16.9,39.2 19,39.3
  pour Top: 0,50 100,50 100,0 0,0
  pour Bottom: 0,50 100,50 100,0 0,0
GREEN
  Top 0.254: R28.2 DONE.C
HALL0
  Top 0.152: J1.2 40.83,41.36 40.83,40.23 45.97,35.1 54.7,35.1 56.56,33.24 56.56,32.78 56.03,32.26 IC1.97
HALL1
  Top 0.152: IC1.96 56.39,31.9 56.92,32.43 56.92,33.51 50.73,39.7 J2.2
HALL2  (via drill 0.35)
  Top 0.152: v57.5,33.5 57.5,32.17 IC1.95
  Bottom 0.152: J3.2 56.7,34.3 v57.5,33.5
HALL3  (via drill 0.35)
  Top 0.152: v58.07,32.93 58.07,32.03 IC1.94
  Bottom 0.152: v58.07,32.93 64.64,39.5 66.22,39.5 67.73,41.01 J4.2
IRQ1  (via drill 0.35)
  Top 0.152: v42.19,27.5 44.29,25.4 IC1.23
  Bottom 0.152: CN2.8 33.36,36.14 42,27.5 v42.19,27.5
IRQ2
  Top 0.152: CN11.7 28.5,42.34 28.5,39 35.5,32 40.86,32 43.34,29.52 43.34,29.25 IC1.19
MISO  (via drill 0.35)
  Top 0.152: IC1.22 44.72,25.78 v43,27.5 40.06,30.44 v25.5,30.44 | JP1.1 24.17,36.31 CN11.5
  Bottom 0.152: CN2.7 35.36,35.14 v43,27.5 | JP1.1 23.9,33.5 23.9,31.1 24.56,30.44 v25.5,30.44
MOSI  (via drill 0.35)
  Top 0.152: IC1.21 45.08,26.21 v42.89,28.39 40.29,31 26.4,31 JP1.4 25.17,32.79 26.49,34.11 26.49,38.35 25.17,39.67 25.17,44.83 24.6,45.4 22.4,45.4 22.17,45.17 CN11.4
  Bottom 0.152: CN2.6 37.36,33.93 v42.89,28.39
N$1
  Top 0.254: Y1.1 39.19,14.84 C6.1 41.59,14.84 IC1.33
N$2  (via drill 0.35)
  Top 0.152: IC1.98 54.37,31.16 v54.37,30.69
  Bottom 0.152: v54.37,30.69 54.37,29.28 C13.1
N$3  (via drill 0.35)
  Top 0.152: IC3.28 26.38,26.04 25.95,26.47 v25.67,26.47 | v24.99,16.86 26.52,16.86 C5.1
  Bottom 0.152: v25.67,26.47 24.99,25.79 v24.99,16.86
N$4
  Top 0.254: Y1.2 43.73,12.28 C7.1 43.73,16.28 IC1.34
N$5
  Top 0.152: RED-ON.C 21.29,26.41 R4.2
N$6
  Top 0.152: R5.2 32.8,21.77 YELLOW-RX0.C
N$7
  Top 0.152: U6.P$5 70.75,22.35 RTHERM.2
N$8
  Top 0.152: R26.1 70.22,26.98 R25.1 71,26.49 71.89,25.61 U6.P$2
N$9
  Top 0.152: R6.2 35.27,23.76 YELLOW-RTX0.C
N$10
  Top 0.152: FS312F-G.5 84.23,26.76 85.21,27.74 C11.2
  Top 0.254: R9.2 84.23,24.33 FS312F-G.5
N$12
  Bottom 0.152: 18.79,35.8 Q1.1 | R7.1 18.25,34.75 18.79,35.29 18.79,35.8 | 18.79,35.8 18.79,35.88 17,35.88 R8.1
N$16
  Top 0.254: FS312F-G.3 FS8205.4
N$17
  Top 0.254: FS312F-G.1 FS8205.6
N$18  (via drill 0.35)
  Top 0.152: FS312F-G.2 84.23,29.73 v84.5,30
  Bottom 0.152: v84.5,30 86.05,30 R10.2
N$25
  Top 0.152: R29.2 76.53,25.02 U6.P$13
N$29
  Top 0.152: R30.2 77.04,23.98 77.04,24.34 76.77,24.61 U6.P$12
ORANGE
  Top 0.254: CHRG/LBO.C 76.09,18.52 R27.2
RST  (via drill 0.35)
  Top 0.152: C5.2 28.59,16.78 | 28.59,16.78 28.77,16.61 B1.B 30.13,14.74 C9.1 33.84,15.7 v35.1,15.7 | 28.59,16.78 28.88,16.78 v30.1,18 30.71,18 R1.1 | v39.09,21.09 41.97,21.09 43.13,19.92 44.55,19.92 IC1.30
  Bottom 0.152: v35.1,15.7 35.1,17.1 v39.09,21.09 | JP1.5 28.23,34.77 29.5,33.5 29.5,18.6 v30.1,18
RX0  (via drill 0.35)
  Top 0.152: IC1.2 51.79,32.69 52.32,32.16 52.32,29.89 45.33,22.9 43.59,22.9 41.66,24.83 33.68,24.83 R5.1 32.18,26.33 v28.74,26.33 | IC3.26 27.38,26.65 v27.45,26.71
  Bottom 0.152: v27.45,26.71 28.36,26.71 v28.74,26.33
RX_DISPLAY
  Top 0.254: CN9.2 11.54,14.54 16.58,9.5 48,9.5 49,10.5 49,13.77 IC1.45
SCK  (via drill 0.35)
  Top 0.152: IC1.20 45.43,26.6 44.9,27.13 44.9,27.17 v42.79,29.29 40.52,31.56 v30.5,31.56 | JP1.3 23.9,33.5 22,33.5 19.9,35.6 19.9,40.1 20.17,40.37 CN11.3
  Bottom 0.152: CN2.5 39.36,32.71 v42.79,29.29 | JP1.3 26.9,36.5 29,36.5 30.5,35 v30.5,31.56
SWITCH0
  Top 0.152: CN3.1 59.62,39.38 63.5,35.5 63.5,33.93 IC1.89
SWITCH1
  Top 0.152: CN4.1 68.43,38.15 IC1.88
SWITCH2
  Top 0.152: CN5.1 77.24,40.59 71.65,35 65.99,35 IC1.87
SWITCH3
  Top 0.152: CN6.1 86.15,40.09 80.56,34.5 66.19,34.5 IC1.86
SWITCH4  (via drill 0.35)
  Top 0.152: v71.5,33.94 66.34,33.94 IC1.85
  Bottom 0.254: v71.5,33.94 77.06,39.5 78,39.5 78.74,40.24 CN7.1
SWITCH5  (via drill 0.35)
  Top 0.152: v72.1,33.4 71.74,33.4 71.73,33.39 66.5,33.39 IC1.84
  Bottom 0.152: CN8.1 87.83,40.47 80.77,33.4 v72.1,33.4
TX0
  Top 0.152: IC1.3 52,31.91 52,30 45.2,23.2 43.72,23.2 41.2,25.73 R6.1 35.33,26.05 34.32,27.06 28.58,27.06 27.88,26.36 IC3.25
TX_DISPLAY
  Top 0.254: IC1.46 49.51,13.57 49.51,10.33 48.17,8.99 16.31,8.99 11.75,13.55 4.95,13.55 4,14.5 4,15.5 5.04,16.54 CN9.3
VBAT  (via drill 0.35)
  Top 0.254: U6.P$1 72.52,26.98 | 72.52,26.98 v72.5,27 | U6.P$20 73.39,26.98 72.52,26.98 | v62,4.5 85.68,4.5 C18.1 88.3,7.12 88.3,9.8 | IC2.5 87.57,9.07 88.3,9.8 | 88.3,9.8 88.3,13.6 87.75,14.15 IC2.1 86.48,14.29 C17.1 86.48,19.02 v84,21.5
  Bottom 0.254: v72.5,27 78,27 83.5,21.5 v84,21.5 | v62,4.5 62,9.32 R2.2
VBUS  (via drill 0.35)
  Top 0.152: IC3.8 26.38,19.78 v26.1,19.5
  Top 0.254: U6.P$3 U6.P$4 71.61,24.61 v71.5,24.5 70.13,24.5 R25.2 | U6.P$17 U6.P$18 U6.P$19 74,27.09 v74,28 | v72.48,3.87 72.31,3.7 49,3.7 48.5,4.2 USB.1 48.46,4.85 48.46,4.17 47.99,3.7 26.8,3.7 v26.5,4 | U6.P$9 74.98,22.48 75.92,21.55 76.82,21.55 77.22,21.14 77.22,15.5 CHRG/LBO.A 76.06,14.34 DONE.A 72.27,14.34 v72.08,14.15
  Bottom 0.254: v72.48,3.87 72.48,13.75 v72.08,14.15 72.08,23.92 v71.5,24.5 71.89,24.89 71.89,27.25 72.25,27.61 73.61,27.61 v74,28 | v26.1,19.5 26.1,4.4 v26.5,4
VLIPO
  Top 0.406: CN1.2 85.62,23.5 R9.1 85.46,23.15 84.6,22.29 82.71,22.29 81.5,23.5 81.5,26 81,26.5 79.83,26.5 78.33,28 | U6.P$15 U6.P$14 | U6.P$15 76.09,26.47 76.09,26.51 75.88,26.72 75.84,26.72 U6.P$16 | C8.1 78.33,28 | 78.33,28 U6.P$15

### Text on the board
bPlace: MakersUPV | Jan 2020 | Rev 1.0